# EAGLE schematic Simple1 (EAGLE 9.3.1)
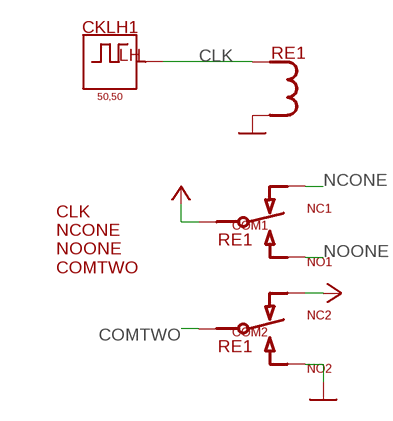
[diagram p0: schematic, sheet 1]

## Parts
CKLH1  50,50  CLOCK_LH  [CK]
RE1  DPDT  [DPDT-GENERIC]

## Nets
CLK: CKLH1.OUT RE1.COIL1(COIL1:COIL1)
COMTWO: RE1.COM2(THROW2:COM2)
GND: RE1.COIL2(COIL1:COIL2) RE1.NO2(THROW2:NO2)
NCONE: RE1.NC1(THROW1:NC1)
NOONE: RE1.NO1(THROW1:NO1)
PWR: RE1.COM1(THROW1:COM1) RE1.NC2(THROW2:NC2)

## Notes on the sheet
- CLK
  							NCONE
  							NOONE
  							COMTWO

## Library data of the parts
CKLH1 = Simurel:CLOCK_LH
RE1 = Simurel:DPDT; ENERGIZING: vvvv--^-^; FOO: BAR; RELEASING: ^^^^^^--v-v-v-v